# Altium schematic sheet Oscillators.SchDoc
size A4; SheetNumber: 3; SheetTotal: 8
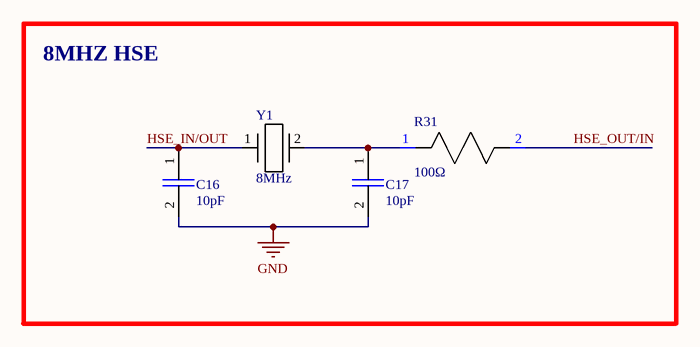
[diagram p0: Oscillators.SchDoc]

## Parts
C16  value 10pF  [0603 Cap]  (hidden comment: 0603 Capacitor)
C17  value 10pF  [0603 Cap]  (hidden comment: 0603 Capacitor)
R31  value 100Ω  [0603 RES]  (hidden comment: Resistor)
Y1  value 8MHz  [ABM3 2PIN SMD]  (hidden comment: XTAL)

## Blocks framed on the sheet
8MHZ HSE: C16 C17 R31 Y1

## Nets
GND: C16.2 C17.2
HSE_IN/OUT: C16.1 Y1.1
HSE_OUT/IN: R31.2
NetC17_1: C17.1 R31.1 Y1.2

## Library data of the parts
C16 C17 = 0603 Cap: SMD 0603 (ceramic) capacitor; Manufacturer: Murata; Manufacturer Part Number: GRM21BR71C225KA12L; Multilayer: Yes; Tolerance  (fill in as +-): 10%; Rated DC Voltage (URdc): 16V; Temperature Characteristics Code: X7R; Supplier: Mouser; Supplier Part Number: 81-GRM21BR71C225KA2L; RoHS: Yes; Category: Ceramic Capacitors; Stock: 30148; Pricing: 1=0,3, 10=0,163, 50=0,163, 100=0,098, 1000=0,07, 10000=0,054 (USD); Mounting Technology: Surface Mount; Pins: 2; Package Shape: Rectangular; Terminal Finish: Nickel; Dielectric Material: Ceramic; Case/Package: 0805; Min Operating Temperature: -55°C; Max Operating Temperature: 125°C; JESD-609 Code: e3; Package Style: SMTMeter; Capacitor Type: Ceramic; Packaging: Tape and Reel; Tolerance (fill in as +-): 10%; Termination: Wraparound; Length: 2mm; Width: 1.25mm; Height: 1.25mm; Reach SVHC Compliant: Yes; RoHS Compliant: Yes; ComponentLink1URL: https://datasheet.ciiva.com:443/pdfs/VipMasterIC/IC/MURE/MURE-S-A0004349797/MURE-S-A0004361718-1.pdf?src-supplier=IHS+Markit; ComponentLink1Description: https://datasheet.ciiva.com:443/pdfs/VipMasterIC/IC/MURE/MURE-S-A0004349797/MURE-S-A0004361718-1.pdf?src-supplier=IHS+Markit; ComponentLink2URL: https://datasheet.ciiva.com/7937/608985-7937701.pdf?src-supplier=Element14; ComponentLink2Description: https://datasheet.ciiva.com/7937/608985-7937701.pdf?src-supplier=Element14
R31 = 0603 Res: Can be used for SMD resistors
Y1 = XTAL: XTAL schematic. Footprint available for many packages